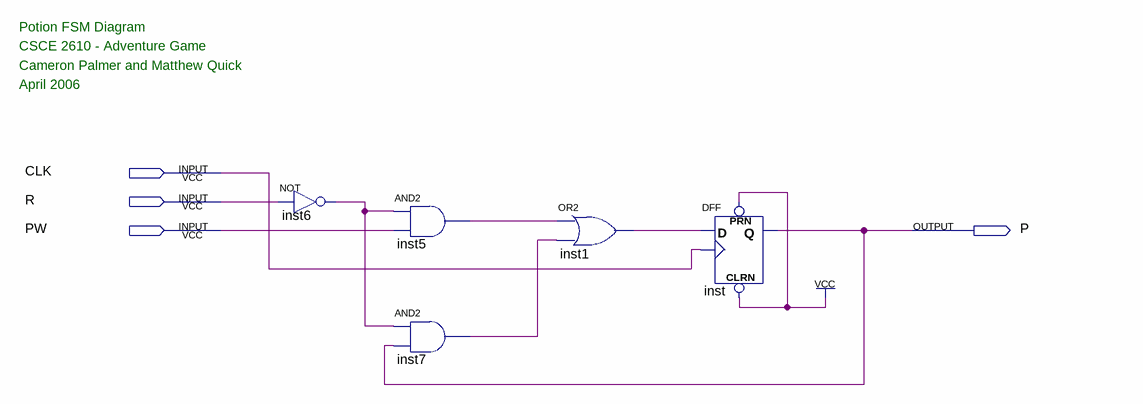
[diagram p0: schematic sheet]
// Quartus schematic potion_fsm.bdf as structural Verilog: 5 symbols, 4 pins
module potion_fsm (
  input  CLK,
  input  R,
  input  PW,
  output P
);

  wire inst1_out, inst5_out, inst6_out, inst7_out;

  not inst6 (inst6_out, R);
  and inst5 (inst5_out, inst6_out, PW);
  and inst7 (inst7_out, inst6_out, P);
  or inst1 (inst1_out, inst5_out, inst7_out);
  DFF inst (.CLRN(1'b1), .CLK(CLK), .D(inst1_out), .PRN(1'b1), .Q(P));

  // Notes on the sheet:
  //   Potion FSM Diagram
  //   CSCE 2610 - Adventure Game
  //   Cameron Palmer and Matthew Quick
  //   April 2006
endmodule
